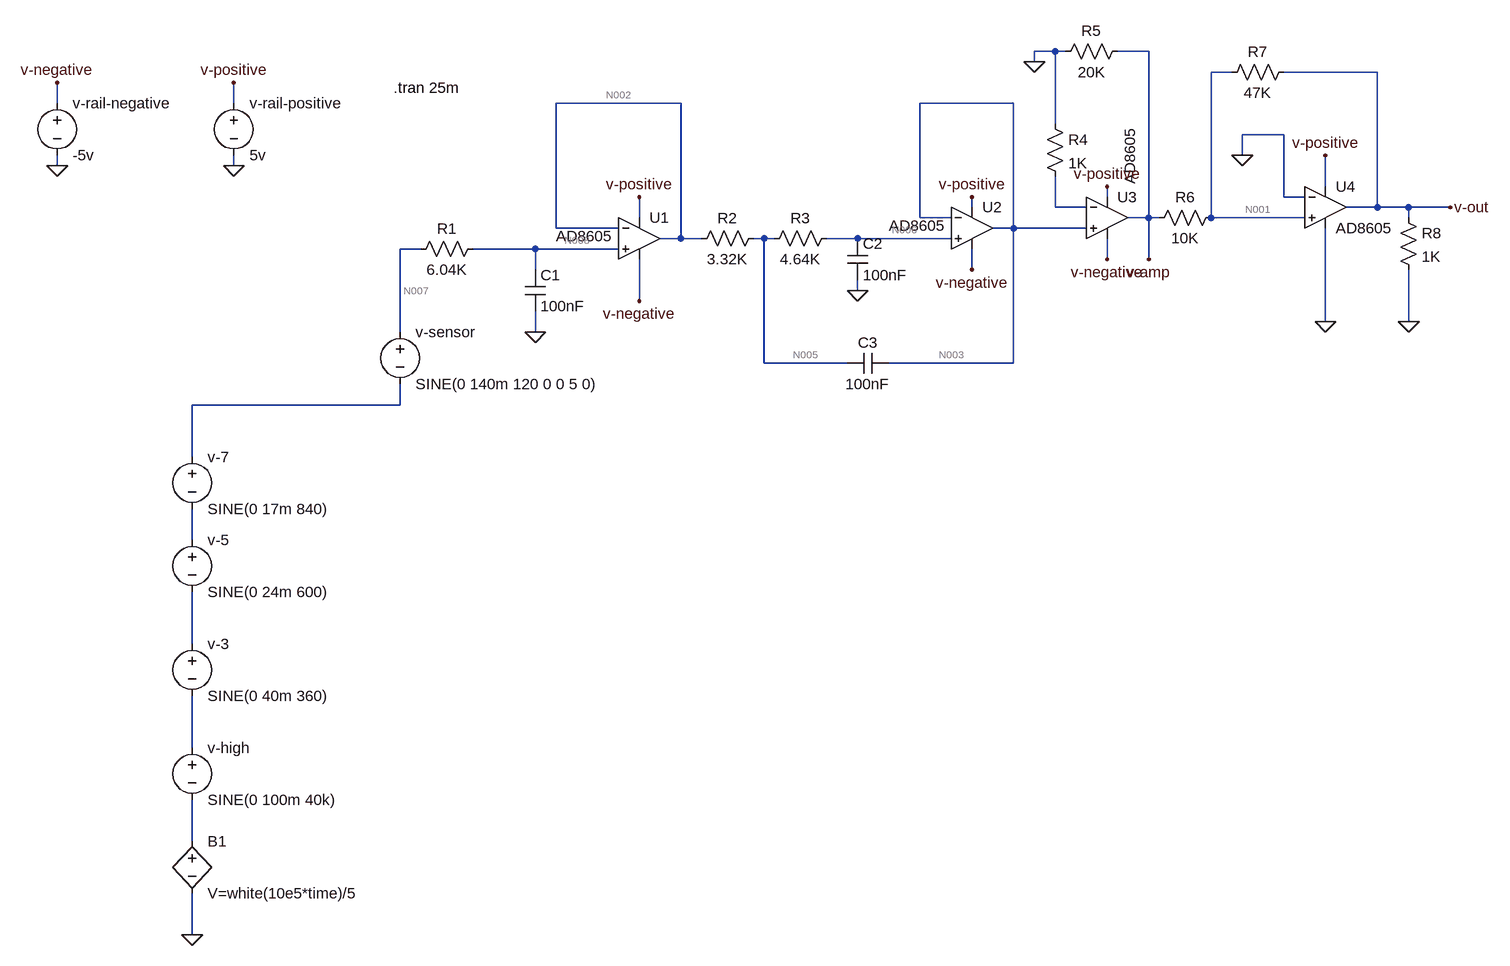
[diagram p0: schematic main.asc]
main.asc, the LTspice schematic file:
Version 4
SHEET 1 1712 1124
WIRE 1024 -256 992 -256
WIRE 1040 -256 1024 -256
WIRE 1168 -256 1120 -256
WIRE 992 -240 992 -256
WIRE 1296 -224 1264 -224
WIRE 1520 -224 1376 -224
WIRE -512 -176 -512 -208
WIRE -240 -176 -240 -208
WIRE 448 -176 256 -176
WIRE 960 -176 816 -176
WIRE 1024 -144 1024 -256
WIRE 1376 -128 1312 -128
WIRE 1312 -96 1312 -128
WIRE -512 -80 -512 -96
WIRE -240 -80 -240 -96
WIRE 1440 -48 1440 -96
WIRE 1104 -32 1104 -48
WIRE 1376 -32 1376 -128
WIRE 1408 -32 1376 -32
WIRE 896 -16 896 -32
WIRE 1024 -16 1024 -64
WIRE 1072 -16 1024 -16
WIRE 1520 -16 1520 -224
WIRE 1520 -16 1472 -16
WIRE 1568 -16 1520 -16
WIRE 1632 -16 1568 -16
WIRE 384 0 384 -32
WIRE 816 0 816 -176
WIRE 864 0 816 0
WIRE 1168 0 1168 -256
WIRE 1168 0 1136 0
WIRE 1184 0 1168 0
WIRE 1264 0 1264 -224
WIRE 1408 0 1264 0
WIRE 1568 0 1568 -16
WIRE 256 16 256 -176
WIRE 352 16 256 16
WIRE 960 16 960 -176
WIRE 960 16 928 16
WIRE 1072 16 960 16
WIRE 448 32 448 -176
WIRE 448 32 416 32
WIRE 480 32 448 32
WIRE 576 32 560 32
WIRE 592 32 576 32
WIRE 720 32 672 32
WIRE 864 32 720 32
WIRE 48 48 16 48
WIRE 224 48 128 48
WIRE 352 48 224 48
WIRE 1104 64 1104 32
WIRE 1168 64 1168 0
WIRE 224 80 224 48
WIRE 896 80 896 48
WIRE 720 112 720 96
WIRE 384 128 384 64
WIRE 1440 160 1440 16
WIRE 1568 160 1568 80
WIRE 16 176 16 48
WIRE 224 176 224 144
WIRE 576 224 576 32
WIRE 704 224 576 224
WIRE 960 224 960 16
WIRE 960 224 768 224
WIRE 16 288 16 256
WIRE 16 288 -304 288
WIRE -304 368 -304 288
WIRE -304 496 -304 448
WIRE -304 656 -304 576
WIRE -304 816 -304 736
WIRE -304 960 -304 896
WIRE -304 1104 -304 1040
FLAG 384 128 v-negative
FLAG -512 -80 0
FLAG -512 -208 v-negative
FLAG -240 -80 0
FLAG -240 -208 v-positive
FLAG 384 -32 v-positive
FLAG 720 112 0
FLAG 896 80 v-negative
FLAG 896 -32 v-positive
FLAG 1104 -48 v-positive
FLAG 1104 64 v-negative
FLAG 1440 160 0
FLAG -304 1104 0
FLAG 1440 -96 v-positive
FLAG 224 176 0
FLAG 992 -240 0
FLAG 1568 160 0
FLAG 1632 -16 v-out
FLAG 1312 -96 0
FLAG 1168 64 v-amp
SYMBOL voltage 16 160 R0
WINDOW 123 0 0 Left 0
WINDOW 39 0 0 Left 0
SYMATTR InstName v-sensor
SYMATTR Value SINE(0 140m 120 0 0 5 0)
SYMBOL OpAmps\\AD8605 384 -32 R0
WINDOW 3 -128 60 Left 2
SYMATTR InstName U1
SYMBOL voltage -512 -192 R0
WINDOW 123 0 0 Left 0
WINDOW 39 0 0 Left 0
SYMATTR InstName v-rail-negative
SYMATTR Value -5v
SYMBOL res 576 16 R90
WINDOW 0 0 56 VBottom 2
WINDOW 3 32 56 VTop 2
SYMATTR InstName R2
SYMATTR Value 3.32K
SYMBOL voltage -240 -192 R0
WINDOW 123 0 0 Left 0
WINDOW 39 0 0 Left 0
SYMATTR InstName v-rail-positive
SYMATTR Value 5v
SYMBOL res 688 16 R90
WINDOW 0 0 56 VBottom 2
WINDOW 3 32 56 VTop 2
SYMATTR InstName R3
SYMATTR Value 4.64K
SYMBOL cap 704 32 R0
SYMATTR InstName C2
SYMATTR Value 100nF
SYMBOL cap 768 208 R90
WINDOW 0 0 32 VBottom 2
WINDOW 3 32 32 VTop 2
SYMATTR InstName C3
SYMATTR Value 100nF
SYMBOL OpAmps\\AD8605 896 -48 R0
WINDOW 3 -128 60 Left 2
SYMATTR InstName U2
SYMBOL OpAmps\\AD8605 1104 -64 R0
WINDOW 3 35 -75 VRight 2
SYMATTR InstName U3
SYMBOL res 1280 -16 R90
WINDOW 0 0 56 VBottom 2
WINDOW 3 32 56 VTop 2
SYMATTR InstName R6
SYMATTR Value 10K
SYMBOL res 1392 -240 R90
WINDOW 0 0 56 VBottom 2
WINDOW 3 32 56 VTop 2
SYMATTR InstName R7
SYMATTR Value 47K
SYMBOL res 144 32 R90
WINDOW 0 0 56 VBottom 2
WINDOW 3 32 56 VTop 2
SYMATTR InstName R1
SYMATTR Value 6.04K
SYMBOL voltage -304 352 R0
SYMATTR InstName v-7
SYMATTR Value SINE(0 17m 840)
SYMBOL voltage -304 480 R0
SYMATTR InstName v-5
SYMATTR Value SINE(0 24m 600)
SYMBOL voltage -304 640 R0
SYMATTR InstName v-3
SYMATTR Value SINE(0 40m 360)
SYMBOL voltage -304 800 R0
SYMATTR InstName v-high
SYMATTR Value SINE(0 100m 40k)
SYMBOL bv -304 944 R0
SYMATTR InstName B1
SYMATTR Value V=white(10e5*time)/5
SYMBOL cap 208 80 R0
SYMATTR InstName C1
SYMATTR Value 100nF
SYMBOL res 1008 -160 R0
SYMATTR InstName R4
SYMATTR Value 1K
SYMBOL res 1136 -272 R90
WINDOW 0 0 56 VBottom 2
WINDOW 3 32 56 VTop 2
SYMATTR InstName R5
SYMATTR Value 20K
SYMBOL res 1552 -16 R0
SYMATTR InstName R8
SYMATTR Value 1K
SYMBOL OpAmps\\AD8605 1440 -80 R0
SYMATTR InstName U4
TEXT 6 -200 Left 2 !.tran 25m

The netlist it stands for:
* main.asc
v-sensor N007 N009 SINE(0 140m 120 0 0 5 0)
XU1 N008 N002 v-positive v-negative N002 AD8605  ; pins In+ In- V+ V- OUT
v-rail-negative v-negative 0 -5v
R2 N005 N002 3.32K
v-rail-positive v-positive 0 5v
R3 N006 N005 4.64K
C2 N006 0 100nF
C3 N003 N005 100nF
XU2 N006 N003 v-positive v-negative N003 AD8605  ; pins In+ In- V+ V- OUT
XU3 N003 N004 v-positive v-negative v-amp AD8605  ; pins In+ In- V+ V- OUT
R6 N001 v-amp 10K
R7 v-out N001 47K
R1 N008 N007 6.04K
v-7 N009 N010 SINE(0 17m 840)
v-5 N010 N011 SINE(0 24m 600)
v-3 N011 N012 SINE(0 40m 360)
v-high N012 N013 SINE(0 100m 40k)
B1 N013 0 V=white(10e5*time)/5
C1 N008 0 100nF
R4 0 N004 1K
R5 v-amp 0 20K
R8 v-out 0 1K
XU4 N001 0 v-positive 0 v-out AD8605  ; pins In+ In- V+ V- OUT
.tran 25m
.lib ADI.lib
.backanno
.end

* Results of the author's LTspice run, read from the files saved beside the schematic
* Operating Point, zero values left out:
*   V(n007) = 12.2 mV
*   V(n002) = 12.03 mV
*   V(v-negative) = -5 V
*   V(v-positive) = 5 V
*   V(n008) = 12.2 mV
*   V(n005) = 12.03 mV
*   V(n006) = 12.03 mV
*   V(n003) = 11.87 mV
*   V(v-amp) = 4.995 V
*   V(n001) = 4.965 V
*   V(v-out) = 4.823 V
*   I(R6) = -3.017 µA
*   I(R7) = -3.017 µA
*   I(R5) = 249.8 µA
*   I(R8) = 4.823 mA
*   I(V-rail-negative) = 2.251 mA
*   I(V-rail-positive) = -7.764 mA